# EAGLE design KeyPad (EAGLE 9.1.0)
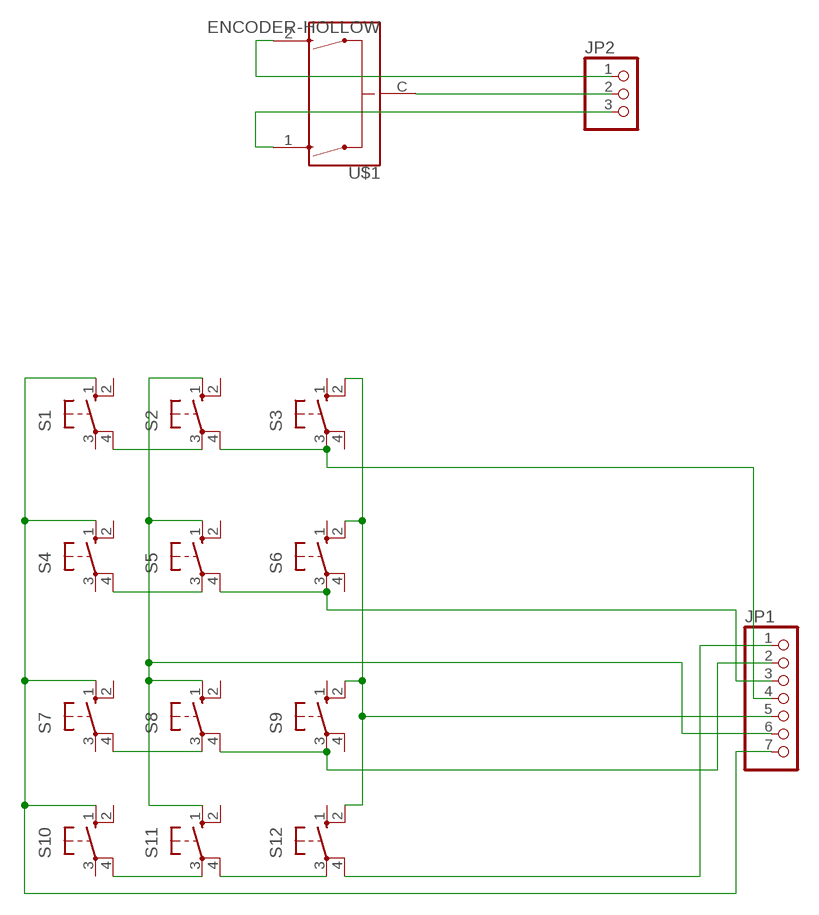
[diagram p0: schematic, sheet 1]

## Parts
JP1  PINHD-1X7/90  [1X07/90]
JP2  PINHD-1X3/90  [1X03/90]
S1  40-XX  [B3F-40XX]
S2  40-XX  [B3F-40XX]
S3  40-XX  [B3F-40XX]
S4  40-XX  [B3F-40XX]
S5  40-XX  [B3F-40XX]
S6  40-XX  [B3F-40XX]
S7  40-XX  [B3F-40XX]
S8  40-XX  [B3F-40XX]
S9  40-XX  [B3F-40XX]
S10  40-XX  [B3F-40XX]
S11  40-XX  [B3F-40XX]
S12  40-XX  [B3F-40XX]
U$1  ENCODER-HOLLOW  [HOLLOW-ENCODER]

## Nets
N$1: JP2.2 U$1.C
N$2: JP2.1 U$1.2(B)
N$3: JP2.3 U$1.1(A)
N$4: S10.4(P1) S11.3(P)
N$5: S11.4(P1) S12.3(P)
N$6: JP1.2 S8.4(P1) S9.3(P)
N$7: S7.4(P1) S8.3(P)
N$8: S4.4(P1) S5.3(P)
N$9: JP1.3 S5.4(P1) S6.3(P)
N$10: S1.4(P1) S2.3(P)
N$11: JP1.4 S2.4(P1) S3.3(P)
N$12: JP1.1 S12.4(P1)
N$13: JP1.7 S1.1(S) S4.1(S) S7.1(S) S10.1(S)
N$14: JP1.6 S2.1(S) S5.1(S) S8.1(S) S11.1(S)
N$15: JP1.5 S3.2(S1) S6.2(S1) S9.2(S1) S12.2(S1)
Unconnected: S1.2(S1) S1.3(P) S2.2(S1) S3.1(S) S3.4(P1) S4.2(S1) S4.3(P) S5.2(S1) S6.1(S) S6.4(P1) S7.2(S1) S7.3(P) S8.2(S1) S9.1(S) S9.4(P1) S10.2(S1) S10.3(P) S11.2(S1) S12.1(S)

## Library data of the parts
JP1 = pinhead:PINHD-1X7: PIN HEADER
JP2 = pinhead:PINHD-1X3: PIN HEADER
S1-S12 = switch-omron:40-XX: OMRON SWITCH; MF: OMRON COMPONENTS USA; MPN: B3F-4000; OC_FARNELL: 176434; OC_NEWARK: 36K3105
U$1 = Flamberm:ENCODER-HOLLOW

## Board
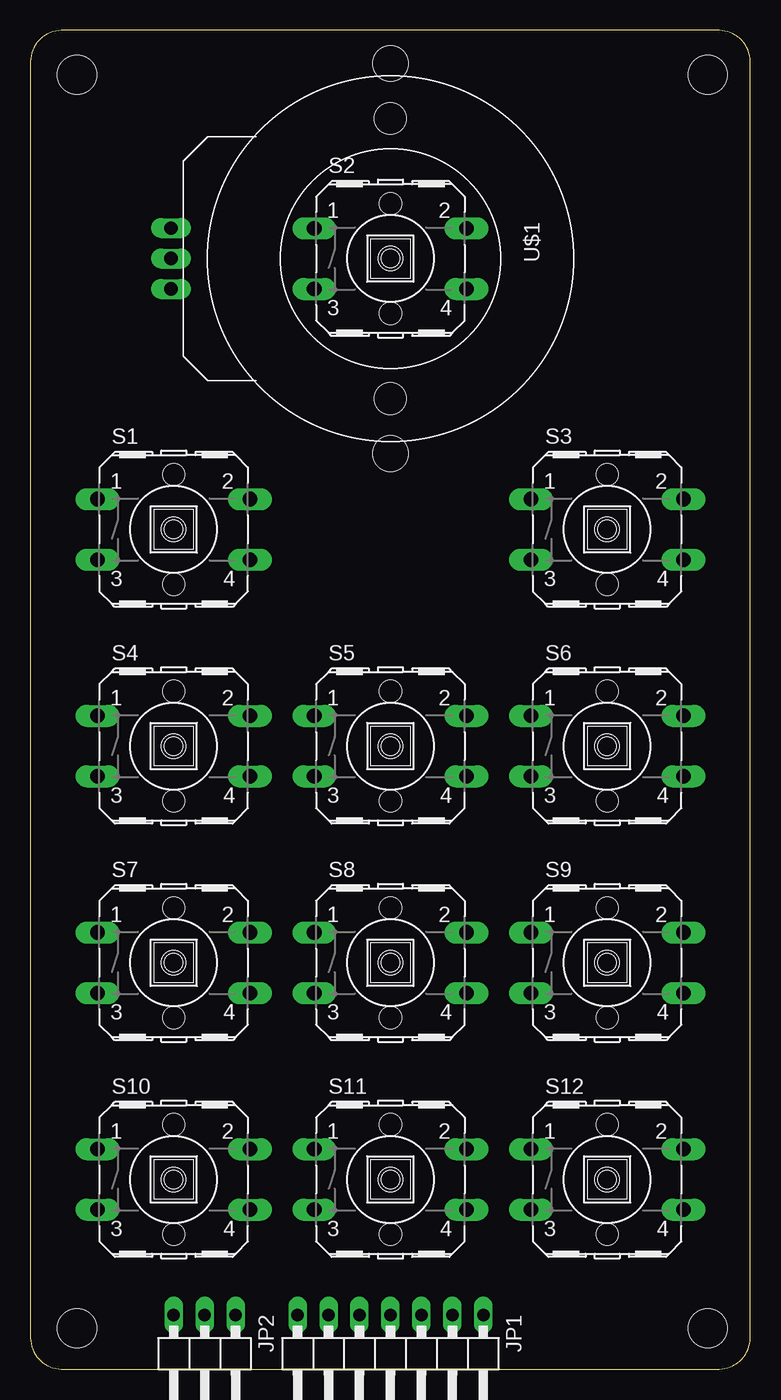
[diagram p1: board, top side]
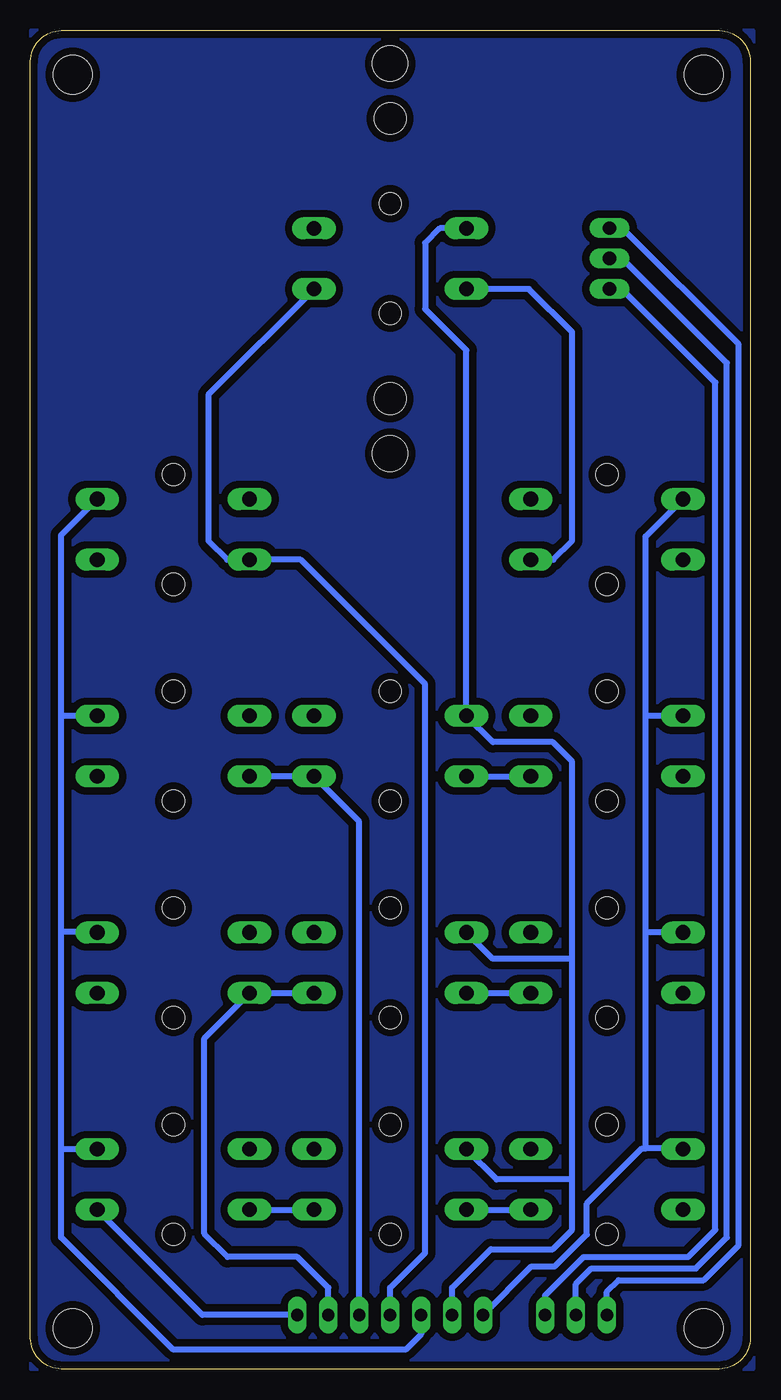
[diagram p2: board, bottom side, seen from below]

Size 59.03 x 109.84 mm. Coordinates in mm from the lower left corner, seen from the top.
Outline: 59.03,2.54 59.03,107.3 arc90 56.49,109.84 2.54,109.84 arc90 0,107.3 0,2.54 arc90 2.54,0 56.49,0 arc90 59.03,2.54
Copper layers (1*16): Top 0.035mm / dielectric 1.5mm / Bottom 0.035mm
Design rules "EagleDesignRules": minimum track width 0.25mm, minimum drill 0.3mm, track to track 0.25mm, track to pad 0.25mm, pad to pad 0.25mm, via to via 0.25mm, smd to smd 0.25mm, copper to edge 0.5mm, drill to drill 0.5mm, minimum pad ring 10mil, minimum via ring 8mil, stop-mask expansion 4mil, vias tented up to drill 0mil, thermal gap 0.25mm
Holes 3.2 mm at 3.81,3.33 55.56,3.33 3.81,106.2 55.56,106.2

### Footprints (pad centres in the part's own frame; a part is rotated, then mirrored left to right if it is on the bottom)
1X07/90 = drill 1.016 long: 1 -7.62,-3.81; 2 -5.08,-3.81; 3 -2.54,-3.81; 4 0,-3.81; 5 2.54,-3.81; 6 5.08,-3.81; 7 7.62,-3.81
1X03/90 = drill 1.016 long: 1 -2.54,-3.81; 2 0,-3.81; 3 2.54,-3.81
B3F-40XX = drill 1.194 long: 1 -6.248,2.489; 2 6.248,2.489; 3 -6.248,-2.489; 4 6.248,-2.489 | hole 1.803: 0,-4.496; 0,4.496
HOLLOW-ENCODER = drill 1.1 long: 1 -2.5,-18; 2 2.5,-18; C 0,-18 | hole 2.6: -11.5,0; 11.5,0 | hole 2.9: -16,0; 16,0

### Placement (x,y rotation side)
JP1  29.53,0.64 180 top
JP2  14.29,0.64 180 top
S1  11.75,68.9 0 top
S2  29.53,91.12 0 top
S3  47.31,68.9 0 top
S4  11.75,51.12 0 top
S5  29.53,51.12 0 top
S6  47.31,51.12 0 top
S7  11.75,33.34 0 top
S8  29.53,33.34 0 top
S9  47.31,33.34 0 top
S10  11.75,15.56 0 top
S11  29.53,15.56 0 top
S12  47.31,15.56 0 top
U$1  29.53,91.12 270 top

### Tracks (layer width: path | path; a pad name or v marks a point on that pad's centre or on a via)
N$1
  Bottom 0.508: U$1.C 10.48,91.12 1.91,82.55 1.91,10.79 4.45,8.26 13.02,8.26 14.29,6.99 JP2.2
N$2
  Bottom 0.508: JP2.1 16.83,6.03 13.65,9.21 5.08,9.21 2.86,11.43 2.86,80.96 10.52,88.62 U$1.2
N$3
  Bottom 0.508: U$1.1 10.48,93.62 0.95,84.1 0.95,10.16 3.81,7.3 10.79,7.3 11.75,6.35 JP2.3
N$4
  Bottom 0.508: S11.3 S10.4
N$5
  Bottom 0.508: S12.3 S11.4
N$6
  Bottom 0.508: JP1.2 34.61,6.67 37.15,9.21 42.86,9.21 44.77,11.11 44.77,27.14 S9.3 S8.4
N$7
  Bottom 0.508: S8.3 S7.4
N$8
  Bottom 0.508: S5.3 S4.4
N$9
  Bottom 0.508: JP1.3 32.07,44.92 S5.4 S6.3
N$10
  Bottom 0.508: S1.4 16.14,66.41 14.61,67.94 14.61,85.09 18.15,88.63 S2.3
N$11
  Bottom 0.508: JP1.4 29.53,6.67 26.67,9.53 26.67,56.2 36.88,66.41 S3.3 42.91,66.41 44.45,67.94 44.45,79.96 S2.4
N$12
  Bottom 0.508: JP1.1 44.93,4.45 S12.4
N$13
  Bottom 0.508: 8.57,18.1 8.57,35.88 | 8.57,35.88 8.57,53.66 | 8.57,53.66 8.57,68.31 S1.1 | S4.1 8.52,53.61 8.57,53.66 | S7.1 8.52,35.83 8.57,35.88 | S10.1 5.55,18.1 8.57,18.1 | JP1.7 17.94,8.41 16.03,8.41 13.4,11.04 13.4,13.58 8.89,18.1 8.57,18.1
N$14
  Bottom 0.508: JP1.6 24.45,6.67 21.27,9.84 16.19,9.84 14.61,11.43 14.61,15.56 | 14.61,15.56 14.61,33.66 | 14.61,33.66 14.61,49.85 16.19,51.44 21.11,51.44 S5.1 23.28,83.6 26.67,86.99 26.67,92.39 25.45,93.61 S2.1 | 14.61,33.66 21.11,33.66 S8.1 | 14.61,15.56 20.79,15.56 S11.1
N$15
  Bottom 0.508: JP1.5 26.99,2.86 28.26,1.59 47.31,1.59 56.52,10.79 56.52,18.1 | 56.52,18.1 56.52,35.88 | 56.52,35.88 56.52,53.66 | 56.52,53.66 56.52,68.43 S3.2 | S6.2 56.46,53.61 56.52,53.66 | S12.2 56.46,18.05 56.52,18.1 | S9.2 53.61,35.88 56.52,35.88
N$16
  pour Bottom (isolate 0.61): -0.32,109.85 59.05,109.85 59.05,0 -0.32,0 -0.32,109.54